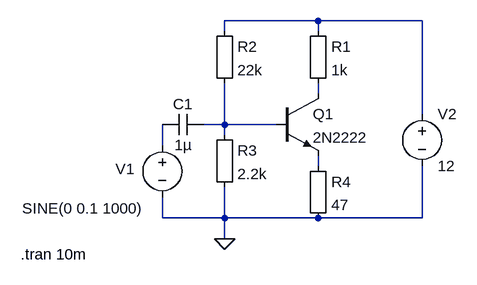
[diagram p0: schematic BJT Pre Amplifier.asc]
BJT Pre Amplifier.asc, the LTspice schematic file:
Version 4
SHEET 1 880 680
WIRE 224 0 80 0
WIRE 384 0 224 0
WIRE 80 16 80 0
WIRE 224 16 224 0
WIRE 224 112 224 96
WIRE 384 144 384 0
WIRE 80 160 80 96
WIRE 80 160 48 160
WIRE 160 160 80 160
WIRE 80 176 80 160
WIRE -16 192 -16 160
WIRE 224 224 224 208
WIRE -16 304 -16 272
WIRE 80 304 80 256
WIRE 80 304 -16 304
WIRE 224 304 80 304
WIRE 384 304 384 224
WIRE 384 304 224 304
WIRE 80 336 80 304
FLAG 80 336 0
SYMBOL npn 160 112 R0
SYMATTR InstName Q1
SYMATTR Value 2N2222
SYMBOL Misc\\EuropeanResistor 208 0 R0
SYMATTR InstName R1
SYMATTR Value 1k
SYMBOL Misc\\EuropeanResistor 64 0 R0
SYMATTR InstName R2
SYMATTR Value 22k
SYMBOL Misc\\EuropeanResistor 64 160 R0
SYMATTR InstName R3
SYMATTR Value 2.2k
SYMBOL Misc\\EuropeanResistor 208 208 R0
SYMATTR InstName R4
SYMATTR Value 47
SYMBOL cap 48 144 R90
WINDOW 0 0 32 VBottom 2
WINDOW 3 32 32 VTop 2
SYMATTR InstName C1
SYMATTR Value 1µ
SYMBOL voltage -16 176 R0
WINDOW 0 -72 52 Left 2
WINDOW 3 -216 113 Left 2
WINDOW 123 0 0 Left 2
WINDOW 39 0 0 Left 2
SYMATTR InstName V1
SYMATTR Value SINE(0 0.1 1000)
SYMBOL voltage 384 128 R0
WINDOW 123 0 0 Left 2
WINDOW 39 0 0 Left 2
SYMATTR InstName V2
SYMATTR Value 12
TEXT -234 360 Left 2 !.tran 10m

The netlist it stands for:
* BJT Pre Amplifier.asc
Q1 N002 N003 N005 0 2N2222
R1 N001 N002 1k
R2 N001 N003 22k
R3 N003 0 2.2k
R4 N005 0 47
C1 N003 N004 1µ
V1 N004 0 SINE(0 0.1 1000)
V2 N001 0 12
.model NPN NPN
.model PNP PNP
.lib standard.bjt
.tran 10m
.backanno
.end